# Altium schematic sheet Sheet5.SchDoc
size A4
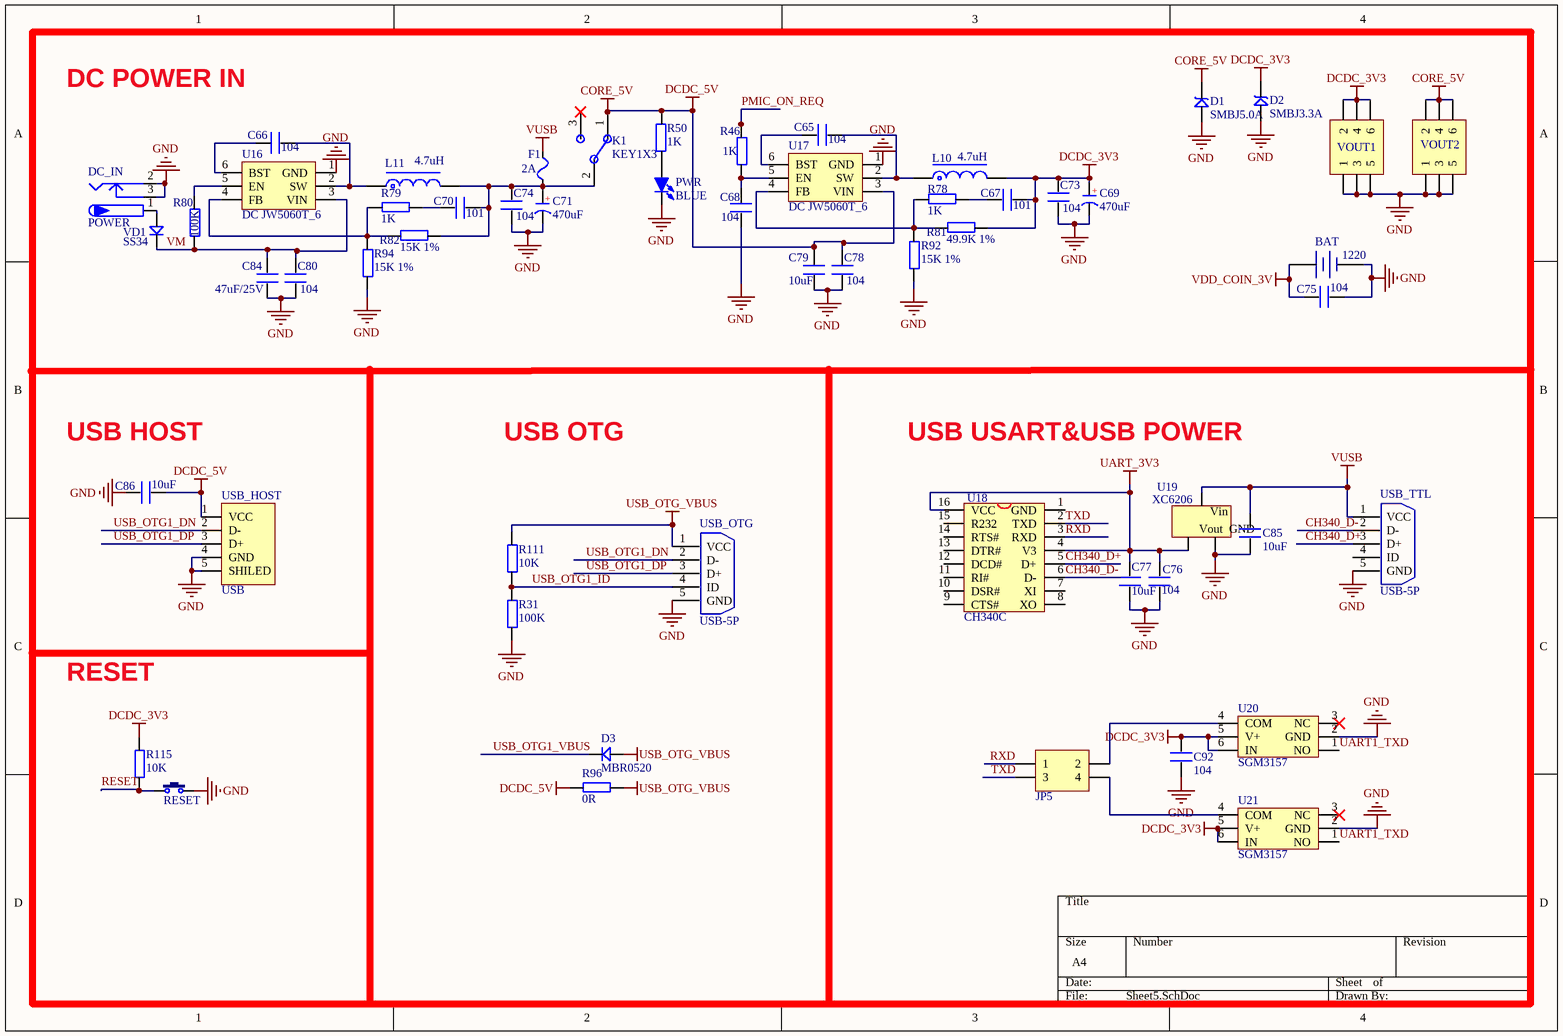
[diagram p0: Sheet5.SchDoc]

## Parts
BAT  1220  [CR1220_B]
C65  104  [C 0603]
C66  104  [C 0603]
C67  101  [C 0603]
C68  104  [C 0603]
C69  470uF  [CM D(6.3*5.4)]
C70  101  [C 0603]
C71  470uF  [CM D(6.3*5.4)]
C73  104  [C 0603]
C74  104  [C 0603]
C75  104  [C 0603]
C76  104  [C 0603]
C77  10uF  [C 0603]
C78  104  [C 0603]
C79  10uF  [C 0603]
C80  104  [C 0603]
C84  47uF/25V  [C 0603]
C85  10uF  [C 0603]
C86  10uF  [C 0603]
C92  104  [C 0603]
D1  SMBJ5.0A  [SMBJ]
D2  SMBJ3.3A  [SMBJ]
D3  MBR0520  [SOD-123F]
DC_IN  POWER  [DC10B]
F1  2A  [FU 1206]
JP5  Header2X2  [HDR-2X2]  (value not drawn)
K1  KEY1X3  [PKEY]
L10  4.7uH  [L-SMD-0420]
L11  4.7uH  [L-SMD-0420]
PWR  BLUE  [LED 0805R]
R31  100K  [R 0603]
R46  1K  [R 0603]
R50  1K  [R 0603]
R78  1K  [R 0603]
R79  1K  [R 0603]
R80  100K  [R 0603]
R81  49.9K 1%  [R 0603]
R82  15K 1%  [R 0603]
R92  15K 1%  [R 0603]
R94  15K 1%  [R 0603]
R96  0R  [R 0603]
R111  10K  [R 0603]
R115  10K  [R 0603]
RESET  KEY  [TSW DIP-6*6*5 - 2]  (value not drawn)
U16  DC JW5060T_6  [SOT23-6N]
U17  DC JW5060T_6  [SOT23-6N]
U18  CH340C  [SOP16_N]
U19  XC6206  [SOT23-3N]
U20  SGM3157  [SOT363-6L]
U21  SGM3157  [SOT363-6L]
USB_HOST  USB  [USB-A/S_E]
USB_OTG  USB-5P  [USB-MINI-A]
USB_TTL  USB-5P  [USB-MINI-A]
VD1  SS34  [SOD-323]
VOUT1  RS232/RS485  [HDR-3X2]  (value not drawn)
VOUT2  RS232/RS485  [HDR-3X2]  (value not drawn)

## Nets
CORE_5V: C78.2 C79.2 C86.1 D1.2 K1.1 R50.1 R96.2 U17.3(VIN) USB_HOST.1(VCC) VOUT2.2 VOUT2.4 VOUT2.6  [also labelled DCDC_5V]
DCDC_3V3: C67.2 C69.1(A) C73.2 C92.2 D2.2 L10.2 R81.1 R115.2 U20.5(V+) U20.6(IN) U21.5(V+) U21.6(IN) VOUT1.2 VOUT1.4 VOUT1.6
GND: BAT.2(DC-) C68.1 C69.2(K) C71.2(K) C73.1 C74.1 C75.2 C76.1 C77.1 C78.1 C79.1 C80.1 C84.1 C85.1 C86.2 C92.1 D1.1 D2.1 DC_IN.2 DC_IN.3 PWR.2(K) R31.1 R92.1 R94.1 RESET.2 U16.1(GND) U17.1(GND) U19.1(GND) U20.2(GND) U21.2(GND) USB_HOST.4(GND) USB_HOST.5(SHILED) USB_OTG.5(GND) USB_TTL.5(GND) VOUT1.1 VOUT1.3 VOUT1.5 VOUT2.1 VOUT2.3 VOUT2.5
UART_3V3: C76.2 C77.2 U18.4(V3) U18.16(VCC) U19.2(Vout)
USB_OTG_VBUS: D3.1(A) R96.1 R111.2 USB_OTG.1(VCC)
VDD_COIN_3V: BAT.1(DC+) C75.1
VUSB: C85.2 F1.2 U19.3(Vin) USB_TTL.1(VCC)
CH340_D+: U18.5(D+) USB_TTL.3(D+)
CH340_D-: U18.6(D-) USB_TTL.2(D-)
PMIC_ON_REQ: R46.2
RESET: R115.1 RESET.1
RXD: JP5.1 U18.3(RXD)
TXD: JP5.3 U18.2(TXD)
UART1_TXD: U20.1(NO) U21.1(NO)
USB_OTG1_DN: USB_HOST.2(D-) USB_OTG.2(D-)
USB_OTG1_DP: USB_HOST.3(D+) USB_OTG.3(D+)
USB_OTG1_ID: R31.2 R111.1 USB_OTG.4(ID)
USB_OTG1_VBUS: D3.2(K)
VM: C80.2 C84.2 R80.1 U16.3(VIN) VD1.2(K)
NetC65_1: C65.1 U17.6(BST)
NetC65_2: C65.2 L10.1 U17.2(SW)
NetC66_1: C66.1 U16.6(BST)
NetC66_2: C66.2 L11.1 U16.2(SW)
NetC67_1: C67.1 R78.1
NetC68_2: C68.2 R46.1 U17.5(EN)
NetC70_1: C70.1 R79.1
NetC70_2: C70.2 C71.1(A) C74.2 F1.1 K1.2 L11.2 R82.1
NetDC_IN_1: DC_IN.1 VD1.1(A)
NetJP5_2: JP5.2 U20.4(COM)
NetJP5_4: JP5.4 U21.4(COM)
NetPWR_1: PWR.1(A) R50.2
NetR78_2: R78.2 R81.2 R92.2 U17.4(FB)
NetR79_2: R79.2 R82.2 R94.2 U16.4(FB)
NetR80_2: R80.2 U16.5(EN)

Not connected (* = marked no-connect by the designer): K1 3*; U18 1(GND) 7(XI) 8(XO) 9(CTS#) 10(DSR#) 11(RI#) 12(DCD#) 13(DTR#) 14(RTS#) 15(R232); U20 3(NC)*; U21 3(NC)*; USB_TTL 4(ID)

## Notes on the sheet
- DC POWER IN
- (near C86) USB HOST
- USB OTG
- USB USART&USB POWER
- RESET
- (in symbol C-CM) +

## Library data of the parts
BAT = CR-3V: 微型电池; 版权归属: 源创客; BOM名称: 微型电池; 学习资源: www.ooocke.com
C65-C68 C70 C73-C80 C84-C86 C92 = C
C69 C71 = C-CM: 贴片电解电容; 版权归属: 源创客; BOM名称: 贴片电解电容; 学习资源: www.ooocke.com
D1 D2 = SMBJ: TVS
D3 VD1 = SS14: 肖特基二极管; 版权归属: 源创客; 属性: 40V/1A; BOM名称: 肖特基二极管; 学习资源: www.ooocke.com
DC_IN = P-DC: 低压电源接口; BOM名称: DC电源接口; 版权归属: 源创客; 学习资源: www.ooocke.com
F1 = FU: 贴片保险丝; 版权归属: 源创客; BOM名称: 贴片保险丝; 学习资源: www.ooocke.com
JP5 = Header 2X2: 2*2P接插件; 版权归属: 源创客; BOM名称: 2*2P接插件; 学习资源: www.ooocke.com
K1 = PKEY
L10 L11 = L-CDRH: 功率屏蔽电感; 版权归属: 源创客; BOM名称: 功率屏蔽电感; 学习资源: www.ooocke.com
PWR = LED-SMD: 贴片LED; 版权归属: 源创客; BOM名称: 贴片LED; 学习资源: www.ooocke.com
R31 R46 R50 R78-R82 R92 R94 R96 R111 R115 = R
RESET = KEY: 按键; BOM名称: 3x6轻触开关; 版权归属: 源创客; 学习资源: www.ooocke.com
U16 U17 = DC JW5060T_6: DC降压芯片
U18 = CH340G: USB2UART
U19 = LDO XC6206: LDO; ComponentLink1Description: 供应商链接; ComponentLink1URL: http://www.szlcsc.com/product/details_5896.html; Package: SOT-23; Supplier: LC; SuppliersPartNumber: C5446
U20 U21 = SGM3157: 单路双掷模拟开关
USB_HOST = USB-A/S: USB-A型母接口; 版权归属: 源创客; BOM名称: USB-A型母接口; 学习资源: www.ooocke.com
USB_OTG USB_TTL = USB-5P: 微型USB母座; 版权归属: 源创客; BOM名称: 微型USB母座; 学习资源: www.ooocke.com
VOUT1 VOUT2 = Header 3X2: 3*2P接插件; 版权归属: 源创客; BOM名称: 3*2P接插件; 学习资源: www.ooocke.com